# Altium schematic sheet 701_GridPos7.SchDoc: Grid Position 7 / USB 6
size A2; Organization: Greenfield Tech Solutions; Address1: Molendreef 33; Address2: Ossendrecht; Address3: 4641CS; Address4: The Netherlands; SheetNumber: 8; SheetTotal: 9
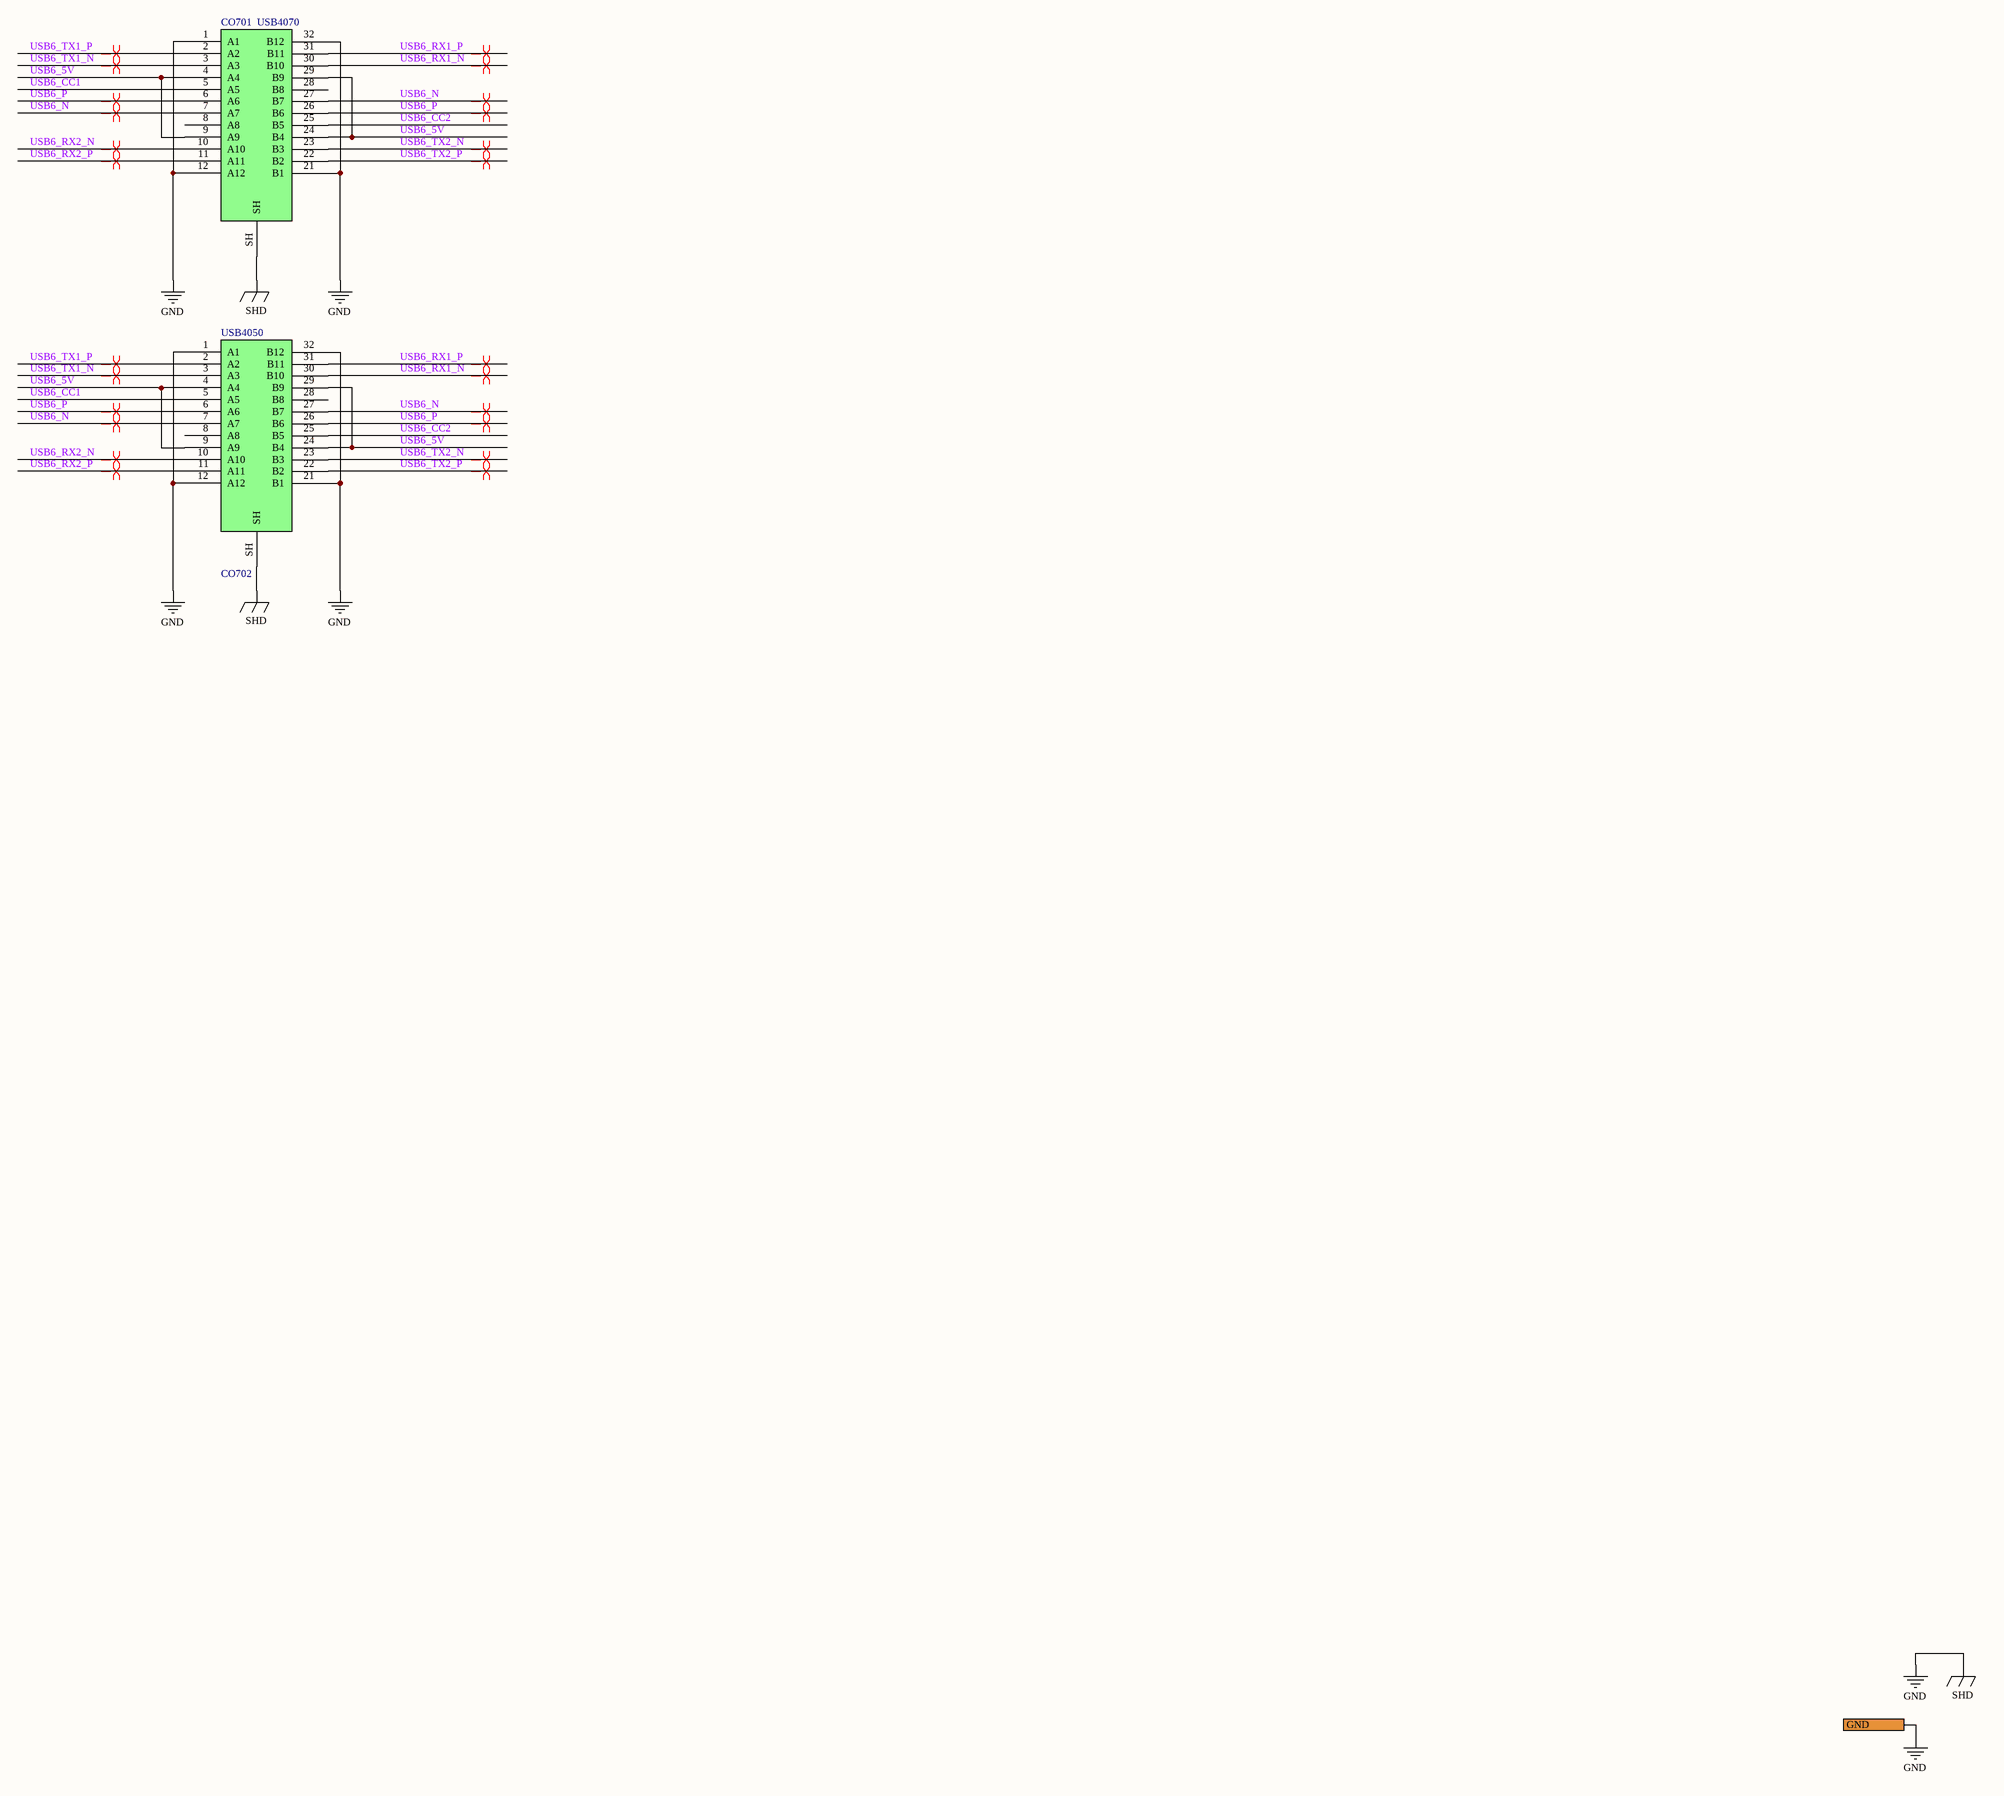
[diagram p0: 701_GridPos7.SchDoc]

## Parts
CO701  USB4070  [USB4070-30-C]
CO702  USB4050  [USB4050-30-A]

## Ports
GND

## Nets
GND: CO701.1(A1) CO701.12(A12) CO701.21(B1) CO701.32(B12) CO701.SH CO702.1(A1) CO702.12(A12) CO702.21(B1) CO702.32(B12) CO702.SH ; port GND  [also labelled SHD]
USB6_5V: CO701.4(A4) CO701.9(A9) CO701.24(B4) CO701.29(B9) CO702.4(A4) CO702.9(A9) CO702.24(B4) CO702.29(B9)
USB6_CC1: CO701.5(A5) CO702.5(A5)
USB6_CC2: CO701.25(B5) CO702.25(B5)
USB6_N: CO701.7(A7) CO701.27(B7) CO702.7(A7) CO702.27(B7)
USB6_P: CO701.6(A6) CO701.26(B6) CO702.6(A6) CO702.26(B6)
USB6_RX1_N: CO701.30(B10) CO702.30(B10)
USB6_RX1_P: CO701.31(B11) CO702.31(B11)
USB6_RX2_N: CO701.10(A10) CO702.10(A10)
USB6_RX2_P: CO701.11(A11) CO702.11(A11)
USB6_TX1_N: CO701.3(A3) CO702.3(A3)
USB6_TX1_P: CO701.2(A2) CO702.2(A2)
USB6_TX2_N: CO701.23(B3) CO702.23(B3)
USB6_TX2_P: CO701.22(B2) CO702.22(B2)

Not connected (* = marked no-connect by the designer): CO701 8(A8) 28(B8); CO702 8(A8) 28(B8)

## Layout directives
differential pair; differential pair class USB3: USB6_N, USB6_P, USB6_RX1_N, USB6_RX1_P, USB6_RX2_N, USB6_RX2_P, USB6_TX1_N, USB6_TX1_P, USB6_TX2_N, USB6_TX2_P

## Notes on the sheet
- Title
- Size:
- Date:
- File:
- A2
- Number:
- Time:
- Revision:
- Sheet
- of

## Library data of the parts
CO701 = CO0021: USB4070-30-C; Part Number: CO0021; ID: 16; RefVal: USB4070; ManfactPart: USB4070-30-C
CO702 = CO0039: USB C connector Receptacle Horizontal; Part Number: CO0039; ID: 39; RefVal: USB4050; ManfactPart: USB4050-30-A